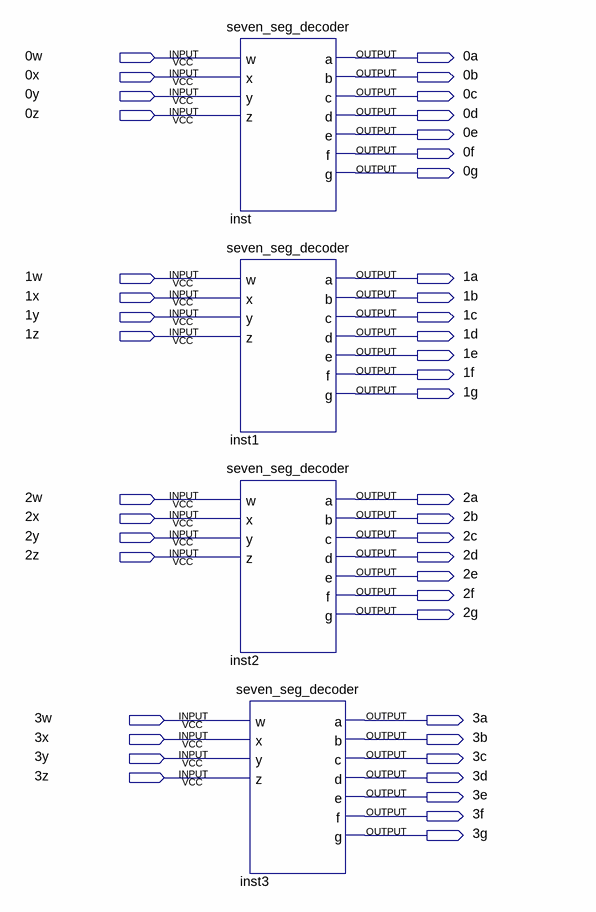
[diagram p0: schematic sheet]
// Quartus schematic lab5step1.bdf as structural Verilog: 4 symbols, 44 pins
module lab5step1 (
  input  \0w ,
  input  \0x ,
  input  \0y ,
  input  \0z ,
  input  \1w ,
  input  \1x ,
  input  \1y ,
  input  \1z ,
  input  \2w ,
  input  \2x ,
  input  \2y ,
  input  \2z ,
  input  \3w ,
  input  \3x ,
  input  \3y ,
  input  \3z ,
  output \0a ,
  output \0b ,
  output \0c ,
  output \0d ,
  output \0e ,
  output \0f ,
  output \0g ,
  output \1a ,
  output \1b ,
  output \1c ,
  output \1d ,
  output \1e ,
  output \1f ,
  output \1g ,
  output \2a ,
  output \2b ,
  output \2c ,
  output \2d ,
  output \2e ,
  output \2f ,
  output \2g ,
  output \3a ,
  output \3b ,
  output \3c ,
  output \3d ,
  output \3e ,
  output \3f ,
  output \3g 
);

  seven_seg_decoder inst (
    .w(\0w ), .x(\0x ), .y(\0y ), .z(\0z ), .a(\0a ), .b(\0b ), .c(\0c ), .d(\0d ), .e(\0e ), .f(\0f ),
    .g(\0g ));
  seven_seg_decoder inst1 (
    .w(\1w ), .x(\1x ), .y(\1y ), .z(\1z ), .a(\1a ), .b(\1b ), .c(\1c ), .d(\1d ), .e(\1e ), .f(\1f ),
    .g(\1g ));
  seven_seg_decoder inst2 (
    .w(\2w ), .x(\2x ), .y(\2y ), .z(\2z ), .a(\2a ), .b(\2b ), .c(\2c ), .d(\2d ), .e(\2e ), .f(\2f ),
    .g(\2g ));
  seven_seg_decoder inst3 (
    .w(\3w ), .x(\3x ), .y(\3y ), .z(\3z ), .a(\3a ), .b(\3b ), .c(\3c ), .d(\3d ), .e(\3e ), .f(\3f ),
    .g(\3g ));
endmodule
